# Altium schematic sheet mixer.SchDoc
size 297 x 209 mm
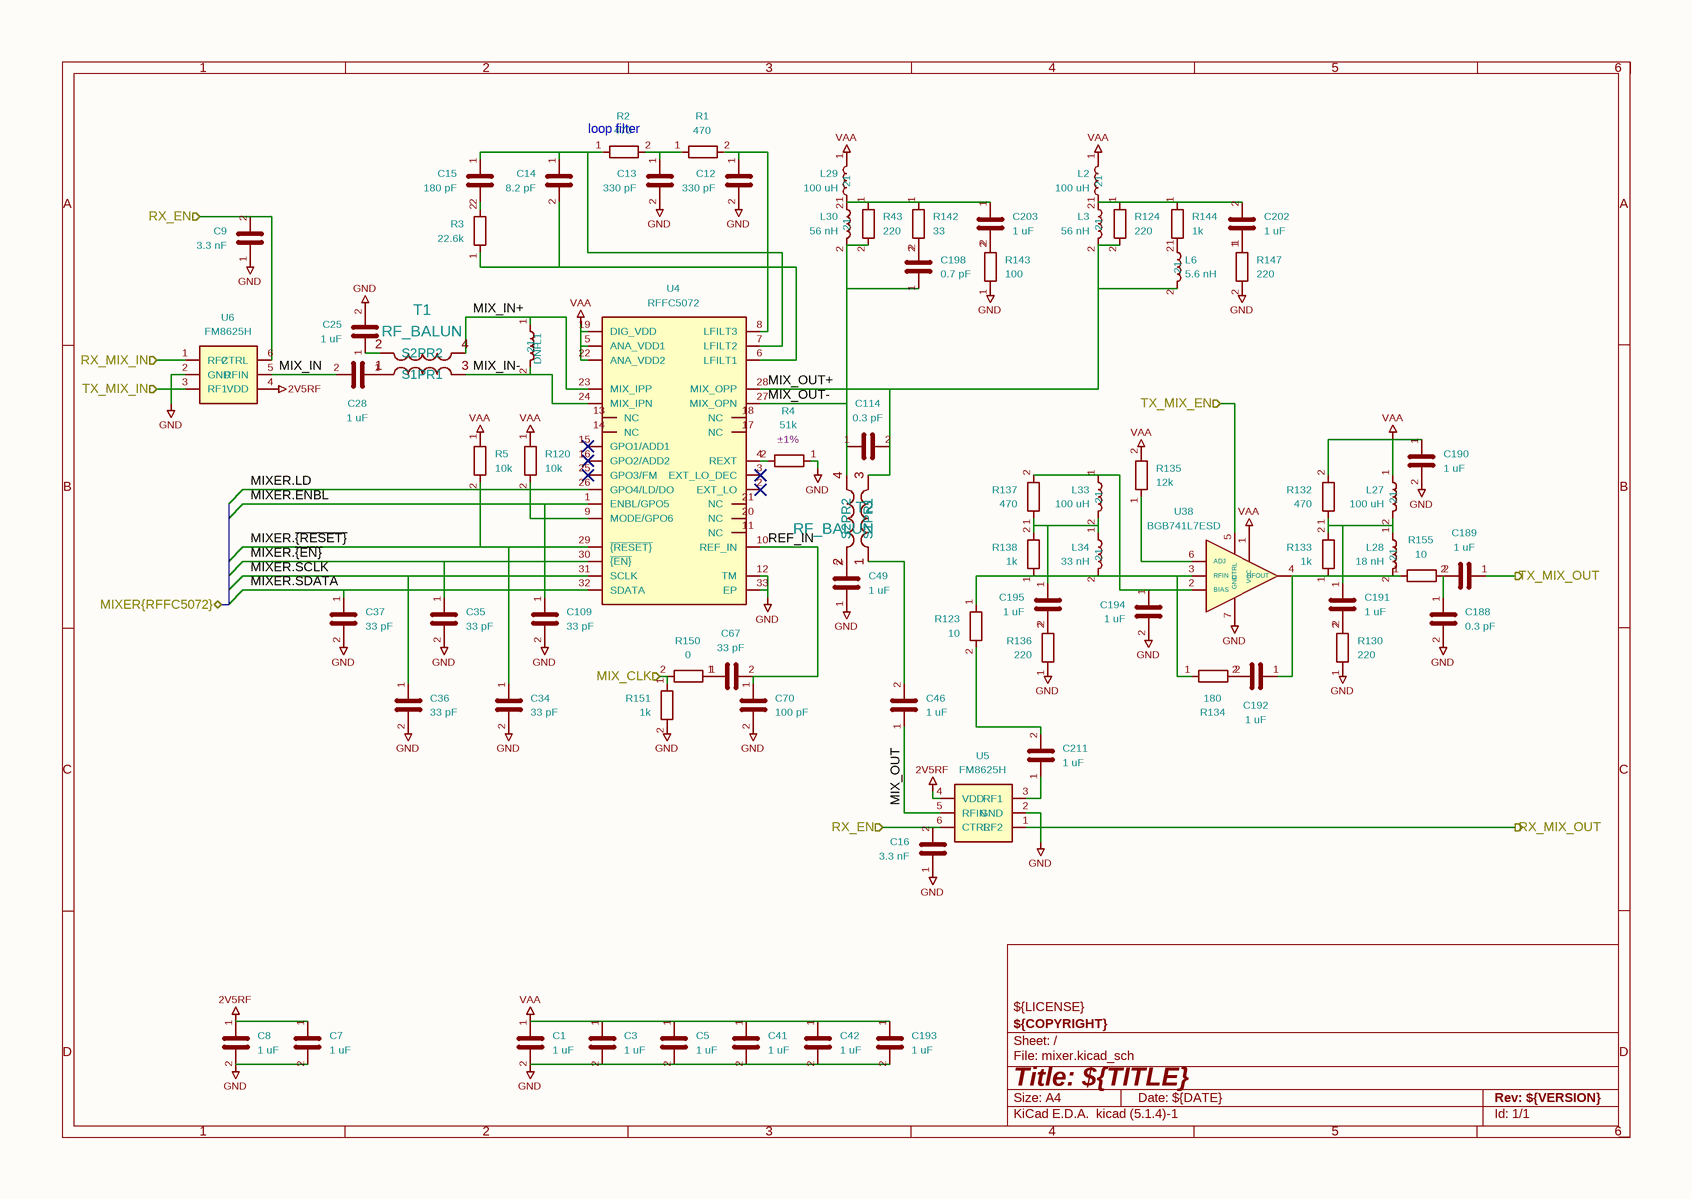
[diagram p0: mixer.SchDoc]

## Parts
C1  1 uF  [C_0201_0603Metric]
C3  1 uF  [C_0201_0603Metric]
C5  1 uF  [C_0201_0603Metric]
C7  1 uF  [C_0201_0603Metric]
C8  1 uF  [C_0201_0603Metric]
C9  3.3 nF  [C_0201_0603Metric]
C12  330 pF  [C_0201_0603Metric]
C13  330 pF  [C_0201_0603Metric]
C14  8.2 pF  [C_0201_0603Metric]
C15  180 pF  [C_0201_0603Metric]
C16  3.3 nF  [C_0201_0603Metric]
C25  1 uF  [C_0201_0603Metric]
C28  1 uF  [C_0201_0603Metric]
C34  33 pF  [C_0201_0603Metric]
C35  33 pF  [C_0201_0603Metric]
C36  33 pF  [C_0201_0603Metric]
C37  33 pF  [C_0201_0603Metric]
C41  1 uF  [C_0201_0603Metric]
C42  1 uF  [C_0201_0603Metric]
C46  1 uF  [C_0201_0603Metric]
C49  1 uF  [C_0201_0603Metric]
C67  33 pF  [C_0201_0603Metric]
C70  100 pF  [C_0201_0603Metric]
C109  33 pF  [C_0201_0603Metric]
C114  0.3 pF  [C_0201_0603Metric]
C188  0.3 pF  [C_0201_0603Metric]
C189  1 uF  [C_0201_0603Metric]
C190  1 uF  [C_0201_0603Metric]
C191  1 uF  [C_0201_0603Metric]
C192  1 uF  [C_0201_0603Metric]
C193  1 uF  [C_0201_0603Metric]
C194  1 uF  [C_0201_0603Metric]
C195  1 uF  [C_0201_0603Metric]
C198  0.7 pF  [C_0201_0603Metric]
C202  1 uF  [C_0201_0603Metric]
C203  1 uF  [C_0201_0603Metric]
C211  1 uF  [C_0201_0603Metric]
L1  DNP  [L_0201_0603Metric]
L2  100 uH  [L_TDK_MLZ2012_h1.25mm]
L3  56 nH  [L_0201_0603Metric]
L6  5.6 nH  [L_0201_0603Metric]
L27  100 uH  [L_TDK_MLZ2012_h1.25mm]
L28  18 nH  [L_0201_0603Metric]
L29  100 uH  [L_TDK_MLZ2012_h1.25mm]
L30  56 nH  [L_0201_0603Metric]
L33  100 uH  [L_TDK_MLZ2012_h1.25mm]
L34  33 nH  [L_0201_0603Metric]
R1  470  [R_0201_0603Metric]
R2  470  [R_0201_0603Metric]
R3  22.6k  [R_0201_0603Metric]
R4  Tolerance: ±1%  [R_0201_0603Metric]  (hidden comment: 51k)
R5  10k  [R_0402_1005Metric]
R43  220  [R_0201_0603Metric]
R120  10k  [R_0402_1005Metric]
R123  10  [R_0201_0603Metric]
R124  220  [R_0201_0603Metric]
R130  220  [R_0201_0603Metric]
R132  470  [R_0201_0603Metric]
R133  1k  [R_0201_0603Metric]
R134  180  [R_0201_0603Metric]
R135  12k  [R_0201_0603Metric]
R136  220  [R_0201_0603Metric]
R137  470  [R_0201_0603Metric]
R138  1k  [R_0201_0603Metric]
R142  33  [R_0201_0603Metric]
R143  100  [R_0201_0603Metric]
R144  1k  [R_0201_0603Metric]
R147  220  [R_0201_0603Metric]
R150  0  [R_0201_0603Metric]
R151  1k  [R_0201_0603Metric]
R155  10  [R_0201_0603Metric]
T1  RF_BALUN  [Anaren_0805_2012Metric-6]
T2  RF_BALUN  [Anaren_0805_2012Metric-6]
U4  RFFC5072  [QFN-32-1EP_5x5mm_P0.5mm_EP3.7x3.7mm_ThermalVias]
U5  FM8625H  [TSLP-6-4_1.1x0.7mm_P0.4mm]
U6  FM8625H  [TSLP-6-4_1.1x0.7mm_P0.4mm]
U38  BGB741L7ESD  [TSLP-7-1]

## Ports
MIX_CLK (in), MIXER{RFFC5072} (bidir), RX_EN (in), RX_MIX_IN (in), RX_MIX_OUT (out), TX_MIX_EN (in), TX_MIX_IN (in), TX_MIX_OUT (out)

## Nets
2V5RF: C7.1 C8.1 U5.4(VDD) U6.4(VDD)
GND: C1.2 C3.2 C5.2 C7.2 C8.2 C9.1 C12.2 C13.2 C16.1 C25.2 C34.2 C35.2 C36.2 C37.2 C41.2 C42.2 C49.1 C70.2 C109.2 C188.2 C190.2 C193.2 C194.2 R4.1 R130.1 R136.1 R143.1 R147.2 R151.2 U4.12(TM) U4.33(EP) U5.2(GND) U6.2(GND) U38.7(GND)
VAA: C1.1 C3.1 C5.1 C41.1 C42.1 C190.1 C193.1 L2.1 L27.1 L29.1 R5.1 R120.1 R132.2 R135.2 U4.5(ANA_VDD1) U4.19(DIG_VDD) U4.22(ANA_VDD2) U38.1(VCC)
MIX_CLK: R150.2 R151.1 ; port MIX_CLK
MIX_IN: C28.2 U6.5(RFIN)
MIX_IN+: L1.1 T1.4(PR2) U4.23(MIX_IPP)
MIX_IN-: L1.2 T1.3(PR1) U4.24(MIX_IPN)
MIX_OUT: C46.1 U5.5(RFIN)
MIX_OUT+: C114.2 L3.2 L6.2 R124.2 T2.3(PR1) U4.28(MIX_OPP)
MIX_OUT-: C114.1 C198.1 L30.2 R43.2 T2.4(PR2) U4.27(MIX_OPN)
MIXER.ENBL: C109.1 U4.1(ENBL/GPO5)
MIXER.LD: U4.26(GPO4/LD/DO)
MIXER.SCLK: C36.1 U4.31(SCLK)
MIXER.SDATA: C37.1 U4.32(SDATA)
MIXER.~{{EN}}: C35.1 U4.30(~{{EN}})
MIXER.~{{RESET}}: C34.1 R5.2 U4.29(~{{RESET}})
REF_IN: C67.2 C70.1 U4.10(REF_IN)
RX_EN: C9.2 C16.2 U5.6(CTRL) U6.6(CTRL) ; port RX_EN
RX_MIX_IN: U6.1(RF2) ; port RX_MIX_IN
RX_MIX_OUT: U5.1(RF2) ; port RX_MIX_OUT
TX_MIX_EN: U38.5(CTRL) ; port TX_MIX_EN
TX_MIX_IN: U6.3(RF1) ; port TX_MIX_IN
TX_MIX_OUT: C189.1 ; port TX_MIX_OUT
NetC12_1: C12.1 R1.2 U4.8(LFILT3)
NetC13_1: C13.1 R1.1 R2.2
NetC14_1: C14.1 C15.1 R2.1 U4.7(LFILT2)
NetC14_2: C14.2 R3.1 U4.6(LFILT1)
NetC15_2: C15.2 R3.2
NetC25_1: C25.1 T1.2(S2)
NetC28_1: C28.1 T1.1(S1)
NetC46_2: C46.2 T2.1(S1)
NetC49_2: C49.2 T2.2(S2)
NetC67_1: C67.1 R150.1
NetC188_1: C188.1 C189.2 R155.2
NetC191_1: C191.1 L27.2 L28.1 R132.1 R133.2
NetC191_2: C191.2 R130.2
NetC192_1: C192.1 L28.2 R133.1 R155.1 U38.4(RFOUT)
NetC192_2: C192.2 R134.2
NetC194_1: C194.1 L33.1 R137.2 U38.2(BIAS)
NetC195_1: C195.1 L33.2 L34.1 R137.1 R138.2
NetC195_2: C195.2 R136.2
NetC198_2: C198.2 R142.2
NetC202_1: C202.1 R147.1
NetC202_2: C202.2 L2.2 L3.1 R124.1 R144.1
NetC203_1: C203.1 L29.2 L30.1 R43.1 R142.1
NetC203_2: C203.2 R143.2
NetC211_1: C211.1 U5.3(RF1)
NetC211_2: C211.2 R123.2
NetL6_1: L6.1 R144.2
NetL34_2: L34.2 R123.1 R134.1 R138.1 U38.3(RFIN)
NetR4_2: R4.2 U4.4(REXT)
NetR120_2: R120.2 U4.9(MODE/GPO6)
NetR135_1: R135.1 U38.6(ADJ)

Not connected (* = marked no-connect by the designer): U4 2(EXT_LO)* 3(EXT_LO_DEC)* 11(NC) 13(NC) 14(NC) 15(GPO1/ADD1)* 16(GPO2/ADD2)* 17(NC) 18(NC) 20(NC) 21(NC) 25(GPO3/FM)*

## Notes on the sheet
- (near R2) loop filter
- 1
- 2
- 3
- 4
- 5
- 6
- A
- B
- C
- ${LICENSE}
- D
- Title: ${TITLE}
- File: mixer.kicad_sch
- Sheet: /
- ${COPYRIGHT}
- KiCad E.D.A.  kicad (5.1.4)-1
- Size: A4
- Date: ${DATE}
- Rev: ${VERSION}
- Id: 1/1

## Library data of the parts
C1 C3 C5 C7 C8 C25 C28 C41 C42 C46 C49 C189-C195 C211 = C: Manufacturer: Murata; Part Number: GRM033R61A105ME44D; Description: CAP CER 1UF 10V X5R 0201; Substitution: GRM033R61A105ME44*, GRM033R61C105ME15*, Samsung CL03A105MO3NRN*; Value: 1 uF; Footprint: Capacitor_SMD:C_0201_0603Metric
C9 C16 = C: Manufacturer: Murata; Part Number: GRM033R71A332KA01D; Description: CAP CER 3300PF 10V X7R 0201; Substitution: GRM033R71A332K*; Value: 3.3 nF; Footprint: Capacitor_SMD:C_0201_0603Metric
C12 C13 = C: Manufacturer: Murata; Part Number: GRM0335C1E331JA01D; Description: CAP CER 330PF 25V C0G/NP0 0201; Substitution: GRM0335C1E331*, GRM0335C1H331*; Value: 330 pF; Footprint: Capacitor_SMD:C_0201_0603Metric
C14 = C: Manufacturer: Murata; Part Number: GRM0335C1H8R2CA01D; Description: CAP CER 8.2PF 50V C0G/NP0 0201; Substitution: GRM0335C1H8R2*; Value: 8.2 pF; Footprint: Capacitor_SMD:C_0201_0603Metric
C15 = C: Manufacturer: Murata; Part Number: GRM0335C1H181JA01D; Description: CAP CER 180PF 50V C0G/NP0 0201; Substitution: GRM0335C1H181*; Value: 180 pF; Footprint: Capacitor_SMD:C_0201_0603Metric
C34-C37 C67 C109 = C: Manufacturer: Murata; Part Number: GRM0335C1H330JA01D; Description: CAP CER 33PF 50V C0G/NP0 0201; Substitution: GRM0335C1H330*, GRM0335C1E330*; Value: 33 pF; Footprint: Capacitor_SMD:C_0201_0603Metric
C70 = C: Manufacturer: Murata; Part Number: GRM0335C1E101JA01D; Description: CAP CER 100PF 25V C0G/NP0 0201; Substitution: GRM0335C1E101JA01*, GRM0335C1H101JA01*; Value: 100 pF; Footprint: Capacitor_SMD:C_0201_0603Metric
C114 C188 = C: Manufacturer: Murata; Part Number: GRM0335C1ER30BA01D; Description: CAP CER 0.3PF 25V C0G/NP0 0201; Substitution: GRM0335C1*R30*A01*, GRM0335C2*R30*A01*; Value: 0.3 pF; Footprint: Capacitor_SMD:C_0201_0603Metric
C198 = C: Manufacturer: Murata; Part Number: GRM0335C1ER70WA01D; Description: CAP CER 0.7PF 25V C0G/NP0 0201; Substitution: GRM0335C1HR70W*, GRM0335C1ER70W*; Value: 0.7 pF; Footprint: Capacitor_SMD:C_0201_0603Metric
C202 = C: Manufacturer: Murata; Part Number: GRM033R61A105ME44D; Description: CAP CER 1UF 10V X5R 0201; Substitution: GRM033R71A222KA01*; Value: 1 uF; Footprint: Capacitor_SMD:C_0201_0603Metric
C203 = C: Manufacturer: Murata; Part Number: GRM033R61A105ME44D; Description: CAP CER 1UF 10V X5R 0201; Substitution: GRM0335C1H8R2*; Value: 1 uF; Footprint: Capacitor_SMD:C_0201_0603Metric
L1 = L: Value: DNP; Footprint: Inductor_SMD:L_0201_0603Metric
L2 L27 L29 L33 = L: Manufacturer: TDK; Part Number: MLZ2012N101LT000; Description: FIXED IND 100UH 140MA 3.5OHM SMD; Substitution: MLZ2012N101LTD25; Value: 100 uH; Footprint: praline:L_TDK_MLZ2012_h1.25mm
L3 L30 = L: Manufacturer: Murata; Part Number: LQP03TN56NJ02D; Description: FIXED IND 56NH 100MA 3.9 OHM SMD; Substitution: LQP03TN56NH02D; Value: 56 nH; Footprint: Inductor_SMD:L_0201_0603Metric
L6 = L: Manufacturer: Murata; Part Number: LQP03TN5N6H02D; Description: FIXED IND 5.6NH 350MA 400MOHM 0201; Value: 5.6 nH; Footprint: Inductor_SMD:L_0201_0603Metric
L28 = L: Manufacturer: Murata; Part Number: LQP03TN18NJ02D; Description: FIXED IND 18NH 200MA 800MOHM SMD; Substitution: LQP03TN56NH02D; Value: 18 nH; Footprint: Inductor_SMD:L_0201_0603Metric
L34 = L: Manufacturer: Murata; Part Number: LQP03TN33NJ02D; Description: FIXED IND 33NH 120MA 2.95OHM SMD; Substitution: LQP03TN56NH02D; Value: 33 nH; Footprint: Inductor_SMD:L_0201_0603Metric
R1 R2 R132 R137 = R: Manufacturer: Yageo; Part Number: RC0201JR-07470RL; Description: RES 470 OHM 5% 1/20W 0201; Substitution: any equivalent; Value: 470; Footprint: Resistor_SMD:R_0201_0603Metric
R3 = R: Manufacturer: Yageo; Part Number: RC0201FR-0722K6L; Description: RES 22.6K OHM 1% 1/20W 0201; Substitution: any equivalent; Value: 22.6k; Footprint: Resistor_SMD:R_0201_0603Metric
R4 = R: Manufacturer: Yageo; Part Number: RC0201FR-0751KL; Description: RES 51K OHM 1% 1/20W 0201; Substitution: any equivalent; Value: 51k; Footprint: Resistor_SMD:R_0201_0603Metric
R5 R120 = R: Manufacturer: Yageo; Part Number: RC0402JR-0710KL; Description: RES 10K OHM 1/16W 5% 0402 SMD; Substitution: any equivalent; Value: 10k; Footprint: Resistor_SMD:R_0402_1005Metric
R43 R124 R130 R136 R147 = R: Manufacturer: Yageo; Part Number: RC0201JR-07220RL; Description: RES 220 OHM 5% 1/20W 0201; Substitution: any equivalent; Value: 220; Footprint: Resistor_SMD:R_0201_0603Metric
R123 R155 = R: Manufacturer: Yageo; Part Number: RC0201JR-0710RL; Description: RES 10 OHM 5% 1/20W 0201; Substitution: any equivalent; Value: 10; Footprint: Resistor_SMD:R_0201_0603Metric
R133 R138 R144 R151 = R: Manufacturer: Yageo; Part Number: RC0201FR-071KL; Description: RES 1K OHM 1% 1/20W 0201; Substitution: any equivalent; Value: 1k; Footprint: Resistor_SMD:R_0201_0603Metric
R134 = R: Manufacturer: Yageo; Part Number: RC0201JR-07180RL; Description: RES 180 OHM 5% 1/20W 0201; Substitution: any equivalent; Value: 180; Footprint: Resistor_SMD:R_0201_0603Metric
R135 = R: Part Number: RC0201FR-0712KL; Manufacturer: Yageo; Description: RES 12K OHM 1% 1/20W 0201; Substitution: any equivalent; Value: 12k; Footprint: Resistor_SMD:R_0201_0603Metric
R142 = R: Manufacturer: Yageo; Part Number: RC0201JR-0733RL; Description: RES 33 OHM 5% 1/20W 0201; Substitution: any equivalent; Value: 33; Footprint: Resistor_SMD:R_0201_0603Metric
R143 = R: Manufacturer: Yageo; Part Number: RC0201JR-07100RL; Description: RES 100 OHM 5% 1/20W 0201; Substitution: any equivalent; Value: 100; Footprint: Resistor_SMD:R_0201_0603Metric
R150 = R: Manufacturer: Yageo; Part Number: RC0201JR-070RL; Description: RES 0 OHM JUMPER 1/20W 0201; Substitution: any equivalent; Value: 0; Footprint: Resistor_SMD:R_0201_0603Metric
T1 T2 = BALUN-B0310J50100AHF: Manufacturer: TTM; Description: Ultra Low Profile 0805 Balun 50 to 100 ohm Balanced; Part Number: B0310J50100AHF; Value: RF_BALUN; Footprint: RF_Converter:Anaren_0805_2012Metric-6
U4 = RFFC5072: Manufacturer: RFMD; Part Number: RFFC5072TR7; Description: WIDEBAND SYNTHESIZER/VCO WITH INTEGRATED 6GHz MIXER; Substitution: RFFC5072*; Value: RFFC5072; Footprint: praline:QFN-32-1EP_5x5mm_P0.5mm_EP3.7x3.7mm_ThermalVias
U5 U6 = BGS12P2L6: Manufacturer: Shenzhen Fuman; Description: SPDT RF SWITCH; Part Number: FM8625H; Value: FM8625H; Footprint: praline:TSLP-6-4_1.1x0.7mm_P0.4mm
U38 = BGB741L7ESD: Manufacturer: Infineon; Part Number: BGB741L7ESDE6327XTSA1; Description: IC AMP CELL 50MHZ-3.5GHZ TSLP7-1; Value: BGB741L7ESD; Footprint: praline:TSLP-7-1